# EasyEDA Pro project ProProject_Stc32f_Car副本_2024-06-03.epro, board STC32G
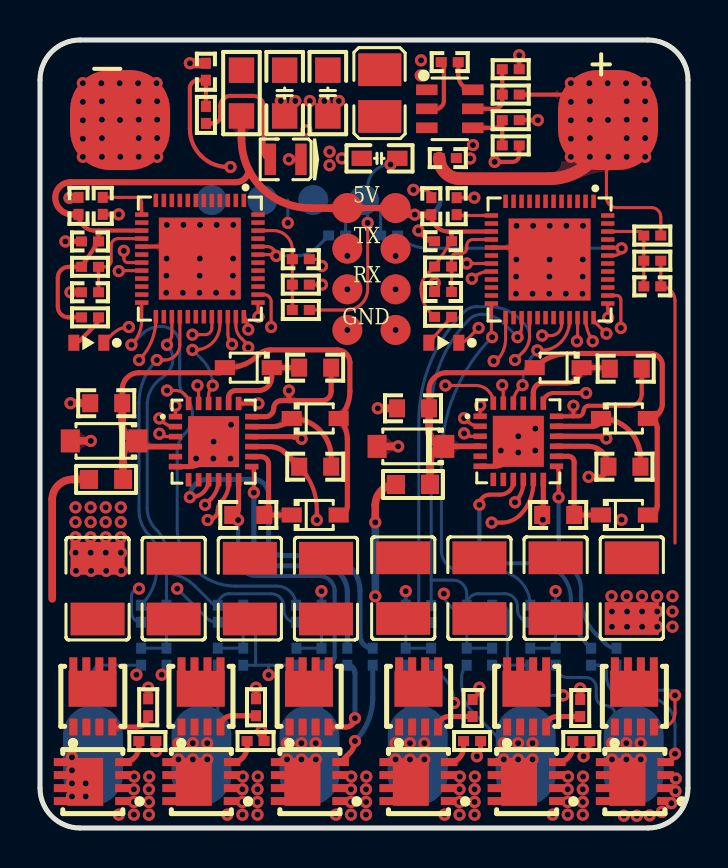
[diagram p13: board, top side]
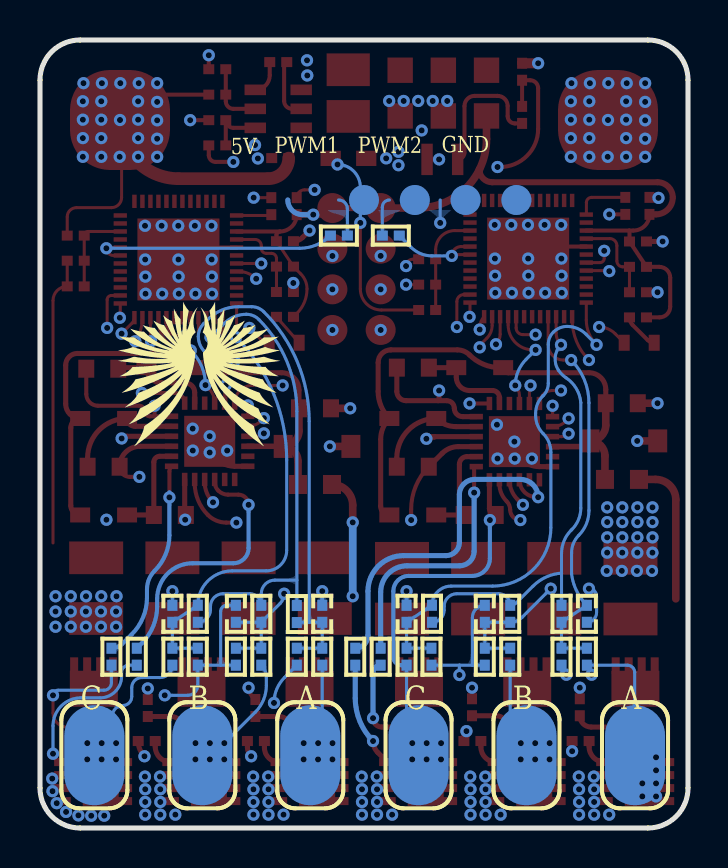
[diagram p14: board, bottom side, seen from below]

Outline 32.4 x 39.4 mm; copper layers: Top Layer, Inner1, Inner2, Bottom Layer. Coordinates in mm from the lower left corner of the outline.
Outline path: 0,37.4 0,2 arc(0.59,0.59) 2,0 30.4,0 arc(31.81,0.59) 32.4,2 32.4,37.4 arc(31.81,38.81) 30.4,39.4 2,39.4 arc(0.59,38.81) 0,37.4
Stack: Top Layer 0.035mm 外层铜厚1oz / Dielectric1 0.2104mm 7628 RC49% 8.6mil / Inner1 0.0152mm 内层铜厚 / Dielectric2 1.065mm 1.1mm H/HOZ 含铜 / Inner2 0.0152mm 内层铜厚 / Dielectric3 0.2104mm 7628 RC49% 8.6mil / Bottom Layer 0.035mm 外层铜厚1oz

## Design rules (mm)
template: 自定义配置
spacing copperThickness1oz (default): track to track 0.152, other pairs 0.152 to 0.3
spacing copperThickness2oz: track to track 0.203, other pairs 0.152 to 0.3
track width copperThickness1oz (default): min 0.152, default 0.254, max 2.54
track width copperThickness2oz: min 0.203, default 0.254, max 2.54
differential pair differentialPair (default): width min 0.127, default 0.254, max 2.54; gap min 0.152, default 0.152
via viaSize (default): diameter min 0.559, default 0.559, max 10; hole min 0.305, default 0.305, max 6.299
pour e34 uses POWGND
pour e58 uses POWGND
pour e72 uses POWGND
pour e106 uses POWGND
pour e118 uses POWGND
pour e125 uses POWGND
pour e181 uses POWGND
pour e610 uses POWGND
pour e621 uses POWGND
pour e570 uses POWGND
pour e1257 uses POWGND
pour e1387 uses POWGND
pour e1405 uses POWGND
pour e1486 uses POWGND
pour e1557 uses POWGND
pour e1626 uses POWGND
pour e4730 uses INSIDEGND
pour e12453 uses INSIDEGND
pour e12604 uses ELSEGND
pour e1581 uses POWGND
pour e1592 uses POWGND
pour e1603 uses POWGND
pour e1614 uses POWGND

## Placement (name value [footprint] x y rotation side)
C3  0.1uF  [CAPC1005[0402]S-N]  20.49 38.3 180 top
C11  4.7uF  [CAPC1608[0603]S-N_1]  13.76 23.02 180 top
C12  4.7uF  [CAPC1608[0603]S-N_1]  13.76 18.06 0 top
C13  10uF  [CAPC1608[0603]S-N_1]  3.31 21.24 0 top
C14  4.7uF  [CAPC1608[0603]S-N_1]  10.41 15.65 0 top
C22  0.1uF  [CAPC1005[0402]S-N]  13.04 28.44 180 top
C23  10uF  [C 0603_M]  16.98 33.48 180 top
C24  0.1uF  [CAPC1005[0402]S-N]  20.39 33.49 180 top
C25  22uF  [C 0805_M]  14.39 36.75 90 top
C26  22uF  [C 0805_M]  12.23 36.75 90 top
C27  100uf  [C1210]  14.3 11.97 270 top
C28  100uf  [C1210]  10.49 11.97 270 top
C29  100uf  [C1210]  6.69 11.97 270 top
C30  100uf  [C1210]  2.88 11.97 270 top
C35  10uF  [CAPC1608[0603]S-N_1]  18.65 20.98 0 top
C36  4.7uF  [CAPC1608[0603]S-N_1]  29.29 22.96 180 top
C37  4.7uF  [CAPC1608[0603]S-N_1]  29.22 18.06 0 top
C38  4.7uF  [CAPC1608[0603]S-N_1]  25.91 15.65 0 top
C48  100uf  [C1210]  18.16 11.99 270 top
C49  100uf  [C1210]  21.97 11.99 270 top
C50  100uf  [C1210]  25.78 11.99 270 top
C51  100uf  [C1210]  29.59 11.99 270 top
C52  0.1uF  [CAPC1005[0402]S-N]  3.14 31.11 90 top
C53  0.1uF  [CAPC1005[0402]S-N]  2.5 29.33 0 top
C54  0.1uF  [CAPC1005[0402]S-N]  1.93 31.11 270 top
C55  0.1uF  [CAPC1005[0402]S-N]  2.5 26.79 0 top
C56  0.1uF  [CAPC1005[0402]S-N]  5.06 10.71 90 bottom
C57  0.1uF  [CAPC1005[0402]S-N]  10.16 10.71 270 bottom
C58  0.1uF  [CAPC1005[0402]S-N]  14.07 10.71 270 bottom
C59  0.1uF  [CAPC1005[0402]S-N]  30.61 27.08 180 top
C60  0.1uF  [CAPC1005[0402]S-N]  18.29 10.71 270 bottom
C61  0.1uF  [CAPC1005[0402]S-N]  22.61 10.71 270 bottom
C62  0.1uF  [CAPC1005[0402]S-N]  25.78 10.71 270 bottom
C63  0.1uF  [CAPC1005[0402]S-N]  20.84 31.09 270 top
C64  0.1uF  [CAPC1005[0402]S-N]  20.15 29.34 0 top
C65  0.1uF  [CAPC1005[0402]S-N]  19.56 31.09 270 top
C66  0.1uF  [CAPC1005[0402]S-N]  20.15 26.8 0 top
C69  0.1uF  [CAPC1005[0402]S-N]  8.3 37.81 270 top
D1  B5819WS  [SOD-323_L1.8-W1.3-LS2.5-RD]  10.41 23.02 180 top
D2  BZT52C15-G RHG  [SOD-123_L2.8-W1.8-LS3.7-RD]  3.21 19.35 180 top
D3  B5819WS  [SOD-323_L1.8-W1.3-LS2.5-RD]  13.76 20.48 0 top
D4  B5819WS  [SOD-323_L1.8-W1.3-LS2.5-RD]  13.76 15.65 0 top
D5  B5819WS  [SOD-323_L1.8-W1.3-LS2.5-RD]  25.91 23.02 180 top
D6  B5819WS  [SOD-323_L1.8-W1.3-LS2.5-RD]  29.22 20.48 0 top
D7  B5819WS  [SOD-323_L1.8-W1.3-LS2.5-RD]  29.22 15.65 0 top
D8  BZT52C15-G RHG  [SOD-123_L2.8-W1.8-LS3.7-RD]  18.55 19.08 180 top
L1  6.8uH  [L1008]  16.99 36.75 90 top
LED1  77fc373f7f6b4e3da7045e8b6ad0bd9c  [LED Chip]  2.44 24.26 180 top
LED2  XL-0807RGB-KS  [LED-SMD_L2.0-W1.8-R-RD]  12.28 33.43 180 top
LED3  77fc373f7f6b4e3da7045e8b6ad0bd9c  [LED Chip]  20.19 24.26 180 top
PAD1  -  [小焊盘4pin]  15.37 27.95 270 top
PAD3  -  [外置焊盘]  28.4 35.4 0 top
PAD5  -  [外置焊盘]  4 35.4 0 top
PAD15  -  [小焊盘4pin]  17.78 27.95 270 top
PAD19  -  [HDR1X4-TP]  16.2 31.4 180 bottom
PAD20  -  [WirePad-4x6 bottom]  2.65 3.64 90 top
PAD21  -  [WirePad-4x6 bottom]  8.07 3.64 90 top
PAD22  -  [WirePad-4x6 bottom]  13.47 3.64 90 top
PAD23  -  [WirePad-4x6 bottom]  18.89 3.64 90 top
PAD24  -  [WirePad-4x6 bottom]  24.28 3.64 90 top
PAD25  -  [WirePad-4x6 bottom]  29.68 3.64 90 top
Q1  -  [MLPAK33-8_L3.2-W3.0-P0.65-LS3.3-BL]  2.64 6.58 0 top
Q2  -  [MLPAK33-8_L3.2-W3.0-P0.65-LS3.3-BL]  8.05 6.58 0 top
Q3  -  [MLPAK33-8_L3.2-W3.0-P0.65-LS3.3-BL]  13.46 6.58 0 top
Q4  -  [MLPAK33-8_L3.2-W3.0-P0.65-LS3.3-BL]  2.64 2.32 90 top
Q5  -  [MLPAK33-8_L3.2-W3.0-P0.65-LS3.3-BL]  8.07 2.32 90 top
Q6  -  [MLPAK33-8_L3.2-W3.0-P0.65-LS3.3-BL]  13.5 2.32 90 top
Q7  -  [MLPAK33-8_L3.2-W3.0-P0.65-LS3.3-BL]  18.93 6.58 0 top
Q8  -  [MLPAK33-8_L3.2-W3.0-P0.65-LS3.3-BL]  18.92 2.32 90 top
Q9  -  [MLPAK33-8_L3.2-W3.0-P0.65-LS3.3-BL]  24.33 6.58 0 top
Q10  -  [MLPAK33-8_L3.2-W3.0-P0.65-LS3.3-BL]  24.33 2.32 90 top
Q11  -  [MLPAK33-8_L3.2-W3.0-P0.65-LS3.3-BL]  29.72 6.58 0 top
Q12  -  [MLPAK33-8_L3.2-W3.0-P0.65-LS3.3-BL]  29.74 2.32 90 top
R12  100R  [RESC1608[0603]S-N_1]  3.3 17.43 180 top
R36  0R  [R 0805_M_1]  10.07 36.75 270 top
R45  100R  [RESC1608[0603]S-N_1]  18.65 17.18 180 top
R64  0R  [RESC1005[0402]S-N]  2.5 28.06 180 top
R65  1k  [RESC1005[0402]S-N]  6.32 8.56 90 bottom
R66  1k  [RESC1005[0402]S-N]  10.16 8.56 90 bottom
R67  1k  [RESC1005[0402]S-N]  12.83 8.56 90 bottom
R68  1k  [RESC1005[0402]S-N]  6.32 10.71 90 bottom
R69  1k  [RESC1005[0402]S-N]  8.89 10.71 90 bottom
R70  1k  [RESC1005[0402]S-N]  12.8 10.71 270 bottom
R71  5.1k  [RESC1005[0402]S-N]  5.05 8.56 270 bottom
R72  5.1k  [RESC1005[0402]S-N]  8.89 8.56 270 bottom
R73  5.1k  [RESC1005[0402]S-N]  14.07 8.56 270 bottom
R74  4.7R  [RESC1005[0402]S-N]  5.41 6.04 90 top
R75  4.7R  [RESC1005[0402]S-N]  5.37 4.35 0 top
R76  4.7R  [RESC1005[0402]S-N]  10.8 6.04 90 top
R77  4.7R  [RESC1005[0402]S-N]  10.78 4.35 0 top
R78  4.7R  [RESC1005[0402]S-N]  15.37 8.56 90 bottom
R79  4.7R  [RESC1005[0402]S-N]  16.64 8.56 90 bottom
R80  47k  [RESC1005[0402]S-N]  13.04 25.9 180 top
R81  10k  [RESC1005[0402]S-N]  13.04 27.17 0 top
R82  4.7k  [RESC1005[0402]S-N]  2.5 25.53 0 top
R83  13.3k  [RESC1005[0402]S-N]  23.54 35.39 0 top
R84  100k  [RESC1005[0402]S-N]  23.54 34.13 0 top
R85  4.7k  [RESC1005[0402]S-N]  8.3 35.65 270 top
R86  511k  [RESC1005[0402]S-N]  23.54 36.67 180 top
R87  105k  [RESC1005[0402]S-N]  23.54 37.94 0 top
R88  100R  [RESC1005[0402]S-N]  14.86 29.62 180 bottom
R89  100R  [RESC1005[0402]S-N]  17.46 29.62 0 bottom
R90  4.7R  [RESC1005[0402]S-N]  21.63 6 90 top
R91  4.7R  [RESC1005[0402]S-N]  21.6 4.35 0 top
R92  4.7R  [RESC1005[0402]S-N]  27.01 6 90 top
R93  4.7R  [RESC1005[0402]S-N]  27.06 4.35 0 top
R94  4.7R  [RESC1005[0402]S-N]  28.83 8.56 90 bottom
R95  4.7R  [RESC1005[0402]S-N]  27.56 8.56 90 bottom
R96  4.7k  [RESC1005[0402]S-N]  20.15 25.56 0 top
R97  10k  [RESC1005[0402]S-N]  30.61 28.36 0 top
R98  47k  [RESC1005[0402]S-N]  30.61 29.62 180 top
R99  1k  [RESC1005[0402]S-N]  19.56 8.56 90 bottom
R100  1k  [RESC1005[0402]S-N]  22.61 8.56 90 bottom
R101  1k  [RESC1005[0402]S-N]  24.51 8.56 90 bottom
R102  1k  [RESC1005[0402]S-N]  19.56 10.7 90 bottom
R103  1k  [RESC1005[0402]S-N]  21.34 10.71 90 bottom
R104  1k  [RESC1005[0402]S-N]  24.51 10.71 270 bottom
R105  5.1k  [RESC1005[0402]S-N]  18.29 8.56 270 bottom
R106  5.1k  [RESC1005[0402]S-N]  21.34 8.56 270 bottom
R107  5.1k  [RESC1005[0402]S-N]  25.78 8.56 270 bottom
R108  0R  [RESC1005[0402]S-N]  20.15 28.07 180 top
U1  STC32G12K128-QFN48  [QFN-48_L6.0-W6.0-P0.40-TL-EP4.1]  7.99 28.47 270 top
U3  FD6288Q  [QFN-24_L4.0-W4.0-P0.50-BL-EP2.6]  8.68 19.32 270 top
U4  TPS54302DDCR  [SOT-23-6_L2.9-W1.6-P0.95-LS2.8-BL]  20.49 35.96 270 top
U6  STC32G12K128-QFN48  [QFN-48_L6.0-W6.0-P0.40-TL-EP4.1]  25.48 28.43 270 top
U7  FD6288Q  [QFN-24_L4.0-W4.0-P0.50-BL-EP2.6]  23.92 19.34 270 top

## Footprints (pads in the part's own frame, mm; a bottom-side part is the same pattern mirrored in y, then rotated)
C1210
  rect 1.635x2.7 smd: 1(-1.518,0) 2(1.518,0)
C 0603_M
  rect 1.016x0.762 smd: 1(-0.889,0) 2(0.889,0)
C 0805_M
  rect 1.27x1.27 smd: 1(-1.143,0) 2(1.143,0)
CAPC1005[0402]S-N
  rect 0.55x0.5 smd: 1(-0.425,0) 2(0.425,0)
CAPC1608[0603]S-N_1
  rect 0.8x0.9 smd: 1(-0.8,0) 2(0.8,0)
HDR1X4-TP
  rrect 1.5x1.5 smd: 1(0,0)
  round 1.5 smd: 2(2.54,0) 3(5.08,0) 4(7.62,0)
L1008
  rect 1.635x2.16 smd: 1(-1.167,0) 2(1.167,0)
LED Chip
  rect 0.55x0.8 smd: A(0.75,0) C(-0.75,0)
LED-SMD_L2.0-W1.8-R-RD
  rect 0.57x1.57 smd: 1(0.765,0) 2(-0.765,0)
MLPAK33-8_L3.2-W3.0-P0.65-LS3.3-BL
  rect 0.4x0.83 smd: 1(-0.975,1.535) 1(-0.325,1.535) 1(0.325,1.535) 1(0.975,1.535) 2(0.975,-1.535) 3(-0.975,-1.535) 3(-0.325,-1.535) 3(0.325,-1.535)
  rect 2.4x1.8 smd: 1(-0.01,0.38)
QFN-24_L4.0-W4.0-P0.50-BL-EP2.6
  rect 0.28x0.665 smd: 1(-1.25,-1.907) 2(-0.75,-1.907) 3(-0.25,-1.907) 4(0.25,-1.907) 5(0.75,-1.907) 6(1.25,-1.907) 13(1.25,1.907) 14(0.75,1.907) 15(0.25,1.907) 16(-0.25,1.907) 17(-0.75,1.907) 18(-1.25,1.907)
  rect 0.665x0.28 smd: 7(1.907,-1.25) 8(1.907,-0.75) 9(1.907,-0.25) 10(1.907,0.25) 11(1.907,0.75) 12(1.907,1.25) 19(-1.907,1.25) 20(-1.907,0.75) 21(-1.907,0.25) 22(-1.907,-0.25) 23(-1.907,-0.75) 24(-1.907,-1.25)
  rect 2.55x2.55 smd: 25(0,0)
QFN-48_L6.0-W6.0-P0.40-TL-EP4.1
  rect 0.665x0.224 smd: 1(-2.908,2.2) 2(-2.908,1.8) 3(-2.908,1.4) 4(-2.908,1) 5(-2.908,0.6) 6(-2.908,0.2) 7(-2.908,-0.2) 8(-2.908,-0.6) 9(-2.908,-1) 10(-2.908,-1.4) 11(-2.908,-1.8) 12(-2.908,-2.2) 25(2.908,-2.2) 26(2.908,-1.8) 27(2.908,-1.4) 28(2.908,-1) 29(2.908,-0.6) 30(2.908,-0.2) 31(2.908,0.2) 32(2.908,0.6) 33(2.908,1) 34(2.908,1.4) 35(2.908,1.8) 36(2.908,2.2)
  rect 0.224x0.665 smd: 13(-2.2,-2.908) 14(-1.8,-2.908) 15(-1.4,-2.908) 16(-1,-2.908) 17(-0.6,-2.908) 18(-0.2,-2.908) 19(0.2,-2.908) 20(0.6,-2.908) 21(1,-2.908) 22(1.4,-2.908) 23(1.8,-2.908) 24(2.2,-2.908) 37(2.2,2.908) 38(1.8,2.908) 39(1.4,2.908) 40(1,2.908) 41(0.6,2.908) 42(0.2,2.908) 43(-0.2,2.908) 44(-0.6,2.908) 45(-1,2.908) 46(-1.4,2.908) 47(-1.8,2.908) 48(-2.2,2.908)
  rect 4.1x4.1 smd: 49(0,0)
R 0805_M_1
  rect 1.27x1.27 smd: 1(-1.143,0) 2(1.143,0)
RESC1005[0402]S-N
  rect 0.55x0.5 smd: 1(-0.425,0) 2(0.425,0)
RESC1608[0603]S-N_1
  rect 0.9x0.95 smd: 1(-0.85,0) 2(0.85,0)
SOD-123_L2.8-W1.8-LS3.7-RD
  rect 0.95x1.15 smd: 1(-1.692,0) 2(1.692,0)
SOD-323_L1.8-W1.3-LS2.5-RD
  rect 1x0.75 smd: 1(-1.173,0) 2(1.173,0)
SOT-23-6_L2.9-W1.6-P0.95-LS2.8-BL
  rect 0.532x1.072 smd: 1(-0.95,-1.149) 2(0,-1.149) 3(0.95,-1.149) 4(0.95,1.149) 5(0,1.149) 6(-0.95,1.149)
WirePad-4x6 bottom
  rrect 5x3 smd far side: 1(0,0)
外置焊盘
  rrect 5x5 smd: 1(0,0)
小焊盘4pin
  round 1.5 smd: 1(-3.048,0) 2(-1.016,0) 3(1.016,0) 4(3.048,0)

## Nets
As in the schematic.

Pads without a net: U1 1 2 3 4 5 6 7 8 9 10 11 12 14 18 21 22 23 26 29 30 31 39 40 41 42 45 47 48; U3 5 7 8 21; U6 1 2 3 4 5 6 7 8 9 10 11 12 14 18 21 22 23 26 29 30 31 39 40 41 42 45 47 48; U7 5 7 8 21

## Via types
v1: diameter 0.61, hole 0.305, Top Layer to Bottom Layer, 340 vias

## Routing (per net, layer and track width the routed paths; a pad name or vN(x,y) marks a point on that pad's centre or on a via; arc(x,y) is an arc through that point)
+5V: length 45.3
  Top Layer w0.152: C64.2 19.73,28.07 19.36,27.7 arc(19.13,27.36) 19.05,26.95 arc(19.18,26.29) 19.56,25.73 19.73,25.56
  Top Layer w0.203: 2.94,29.87 2.74,29.87 arc(2.16,30.11) C54.2 ; 2.94,29.87 U1.15 ; 2.94,29.87 arc(2.93,29.87) 2.93,29.86 C53.2 R64.2 1.44,28.06 arc(1.05,27.9) 0.89,27.51 0.89,26.07 arc(1.05,25.69) 1.43,25.53 R82.1 ; C64.2 20.58,29.65 arc(20.53,29.78) 20.41,29.83 ; U6.15 20.41,29.83 ; 20.41,29.83 arc(19.81,30.07) C65.2
  Top Layer w0.305: C54.2 1.61,30.68 arc(1.01,30.93) 0.76,31.53 arc(0.99,32.06) 1.52,32.29 9.79,32.29 arc(10.24,32.47) 10.43,32.92 ; PAD1.1 PAD15.1 arc(17.88,30.76) 18.11,30.67 v1(18.74,30.67) C65.2
  Top Layer w0.381: PAD1.1 13.52,31 arc(11.7,31.52) 10.43,32.92 arc(10.16,33.67) 10.07,34.45 R36.2
  Bottom Layer w0.254: v1(18.74,30.67) 19.28,30.67 arc(19.8,30.88) 20.01,31.4
GND: length 59.6
  Top Layer w0.152: R97.2 31.04,27.08 arc(31.54,26.87) 31.75,26.37 31.75,14.25 ; v1(18.67,31.91) 19.18,31.91 arc(19.45,31.79) C65.1 ; v1(19.73,27.25) 19.73,26.82 arc(19.73,26.81) C66.1 ; R81.2 v1(14.1,27.17) ; C22.1 13.75,28.44 arc(14,28.34) v1(14.1,28.1) ; C63.1 v1(21.72,31.52)
  Top Layer w0.203: R87.2 v1(23.96,38.64) ; U6.17 23.49,29.03 ; C55.1 v1(1.52,26.79) ; LED2.2 v1(12.45,33.43) ; C52.1 v1(3.94,30.68) ; R83.2 v1(24.89,35.39) ; 5.09,29.07 6.06,29.07
  Top Layer w0.254: C53.1 v1(1.27,29.33) ; v1(18.92,29.88) 19.27,29.53 arc(19.48,29.39) C64.1 ; U7.6 22.67,18.09 arc(23.33,18.28) 23.79,18.8 arc(23.88,19.06) U7.25 ; U3.6 7.43,18.07 arc(8.31,18.43) v1(8.68,19.32)
  Top Layer w0.305: v1(1.48,31.51) 1.9,31.51 arc(1.92,31.51) C54.1
  Top Layer w0.381: C13.1 v1(1.52,21.24) ; D8.2 v1(17.91,19.08) ; 1.51,19.35 v1(2.54,19.35) ; C35.1 v1(16.89,20.98)
  Top Layer w0.508: C69.1 v1(7.49,38.24)
  Bottom Layer w0.152: 11.43,8.14 12.83,8.14 ; 11.43,8.14 v1(11.43,7.65) ; 11.43,8.14 10.78,8.14 ; R100.1 23.37,8.14 ; 23.37,8.14 R101.1 24.51,7.14 arc(24.66,6.78) 25.02,6.63 v1(26.16,6.63) ; 23.37,8.14 arc(23.37,8.14) 23.37,8.14 23.37,10.83 arc(23.28,11.04) 23.06,11.14 C61.1 ; 12.39,31.4 v1(12.39,30.26) ; R99.1 20.18,7.52 arc(20.56,6.94) v1(20.7,6.25) ; R65.1 6.32,7.91 arc(6.25,7.74) v1(6.08,7.66) ; C62.1 v1(25.78,11.84) ; 10.78,8.14 R66.1 ; 10.78,8.14 10.78,10.51 arc(10.6,10.95) C57.1 ; C56.1 arc(4.71,10.43) 4.57,10.77 4.57,11.59 arc(4.68,11.86) v1(4.95,11.97)
  Bottom Layer w0.203: C60.1 v1(18.29,11.84) ; C58.1 v1(14.07,11.84)
  vias: v1(1.78,16.03) v1(1.78,15.3) v1(1.78,14.53) v1(1.78,13.77) v1(1.8,12.86) v1(2.14,37.24) v1(2.14,36.31) v1(2.14,35.38) v1(2.14,34.46) v1(2.14,33.56) v1(2.53,16.03) v1(2.53,15.3) v1(2.53,14.53) v1(2.53,13.77) v1(2.55,12.86) v1(3.06,37.24) v1(3.09,36.34) v1(3.09,35.42) v1(3.09,34.49) v1(3.09,33.56) v1(3.29,16.03) v1(3.29,15.3) v1(3.29,14.53) v1(3.29,13.77) v1(3.31,12.86) v1(3.94,0.67) v1(3.98,37.24) v1(4,35.4) v1(4.02,33.56) v1(4.04,16.03) v1(4.04,15.3) v1(4.04,14.53) v1(4.04,13.77) v1(4.06,12.86) v1(4.71,2.57) v1(4.69,1.94) v1(4.69,1.3) v1(4.69,0.67) v1(4.91,37.24) v1(4.94,36.34) v1(4.94,35.42) v1(4.94,34.49) v1(4.94,33.56) v1(5.45,1.94) v1(5.45,1.3) v1(5.45,0.67) v1(5.46,2.57) v1(5.83,37.24) v1(5.86,36.34) v1(5.86,35.42) v1(5.86,34.49) v1(5.86,33.56) v1(6.34,30.16) v1(6.33,28.47) v1(6.32,27.62) v1(6.31,26.76) v1(7.14,26.76) v1(7.17,30.16) v1(7.81,18.47) v1(8,30.16) v1(7.99,28.47) v1(7.98,27.62) v1(7.97,26.76) v1(8.67,18.47) v1(8.83,30.16) v1(8.81,26.76) v1(9.37,0.67) v1(9.53,18.47) v1(9.65,27.62) v1(9.64,26.76) v1(9.55,20.16) v1(9.66,30.16) v1(9.66,28.47) v1(10.13,2.57) v1(10.12,1.94) v1(10.12,1.3) v1(10.12,0.67) v1(10.89,2.57) v1(10.87,1.94) v1(10.87,1.3) v1(10.87,0.67) v1(12.04,36.35) v1(12.76,36.35) v1(13.32,34.88) v1(13.49,36.35) v1(14.22,36.35) v1(14.48,33.81) v1(14.48,33.14) v1(14.79,0.67) v1(14.94,36.35) v1(15.09,33.48) v1(15.37,24.9) v1(15.55,1.94) v1(15.55,1.3) v1(15.55,0.67) v1(15.56,2.57) v1(16.31,2.57) v1(16.3,1.94) v1(16.3,1.3) v1(16.3,0.67) v1(17.78,24.9) v1(19.04,37.63) v1(19.05,38.38) v1(20.22,0.67) v1(20.99,2.57) v1(20.98,1.94) v1(20.98,1.3) v1(20.98,0.67) v1(21.51,33.48) v1(21.65,34.15) v1(21.74,2.57) v1(21.73,1.94) v1(21.73,1.3) v1(21.73,0.67) v1(23.04,18.87) v1(23.82,30.11) v1(23.82,28.43) v1(23.81,27.57) v1(23.8,26.71) v1(23.92,19.59) v1(23.92,18.78) v1(24.63,26.71) v1(24.66,30.11) v1(24.76,19.97) v1(24.76,18.87) v1(25.49,30.11) v1(25.48,28.43) v1(25.47,27.57) v1(25.46,26.71) v1(25.63,0.67) v1(26.32,30.11) v1(26.29,26.71) v1(26.4,2.57) v1(26.39,1.94) v1(26.39,1.3) v1(26.39,0.67) v1(27.14,28.43) v1(27.13,27.57) v1(27.12,26.71) v1(27.14,1.94) v1(27.14,1.3) v1(27.14,0.67) v1(27.15,30.11) v1(27.15,2.57) v1(29.19,0.62) v1(29.84,0.61) v1(30.48,0.63) v1(31.1,0.8) v1(31.56,1.24) v1(31.79,2.47) v1(31.78,1.84)
VBAT: length 44.9
  Top Layer w0.152: R80.1 15.33,25.9 arc(16.07,26.21) 16.38,26.95 v1(16.38,30.26) ; R98.1 31.04,30.56 arc(30.9,30.88) 30.58,31.02 28.83,31.02 arc(28.47,31.17) 28.32,31.53 28.32,35.32 arc(28.34,35.38) v1(28.4,35.4)
  Top Layer w0.203: R86.1 26.1,36.67
  Top Layer w0.381: R12.2 1.63,17.43 arc(0.91,17.13) 0.61,16.41 0.61,11.46 ; v1(16.76,15.28) 16.76,16.14 arc(17.07,16.87) R45.2
  Top Layer w0.635: C24.2 arc(20.27,32.77) 20.99,32.47 25.47,32.47 arc(26.65,32.72) 27.64,33.43 arc(28.06,34.03) 28.32,34.72 arc(28.38,35.06) v1(28.4,35.4)
  Bottom Layer w0.152: v1(16.38,30.26) 16.38,32.03 arc(16.72,32.84) v1(17.53,33.18)
  Bottom Layer w0.381: v1(16.76,15.28) v1(16.76,11.59)
  vias: v1(26.54,37.24) v1(26.54,36.31) v1(26.54,35.38) v1(26.54,34.46) v1(26.54,33.56) v1(27.46,37.24) v1(27.49,36.34) v1(27.49,35.42) v1(27.49,34.49) v1(27.49,33.56) v1(28.38,37.24) v1(28.42,33.56) v1(28.57,11.59) v1(28.6,10.83) v1(28.6,10.06) v1(29.08,15.41) v1(29.31,37.24) v1(29.34,36.34) v1(29.34,35.42) v1(29.34,34.49) v1(29.34,33.56) v1(29.34,11.59) v1(29.35,10.83) v1(29.35,10.06) v1(30.1,11.59) v1(30.11,10.83) v1(30.11,10.06) v1(30.23,37.24) v1(30.26,36.34) v1(30.26,35.42) v1(30.26,34.49) v1(30.26,33.56) v1(30.86,11.59) v1(30.86,10.83) v1(30.86,10.06) v1(31.62,11.59) v1(31.62,10.83) v1(31.62,10.06)
VCC12V: length 28.1
  Top Layer w0.254: C13.2 4.11,21.92 arc(4.36,22.52) 4.95,22.76 8.99,22.76 arc(9.17,22.84) D1.2 9.39,23.02 arc(10.22,23.18) 10.92,23.65 arc(11.2,23.84) 11.53,23.91 14.86,23.91 arc(15.31,23.72) 15.49,23.27 15.49,21.83 arc(15.35,21.1) D3.2 arc(15.25,20) 15.37,19.43 15.37,16.09 arc(15.24,15.78) D4.2
  Top Layer w0.28: U3.4 5.19,19.07 arc(4.98,19.15) D2.1
  Top Layer w0.381: C13.2 4.11,20.14 arc(4.34,19.59) D2.1 arc(4.37,19.14) 4.15,18.61 R12.1
VCC12V1: length 28.6
  Top Layer w0.254: C35.2 19.45,21.89 arc(19.71,22.51) 20.32,22.76 24.12,22.76 arc(24.45,22.83) D5.2 arc(25.52,23.54) 26.45,23.73 30.53,23.73 arc(30.94,23.56) 31.12,23.14 31.12,21.2 arc(30.9,20.69) D6.2 arc(30.72,20.34) 30.86,20.01 30.86,16.12 arc(30.72,15.79) D7.2
  Top Layer w0.28: U7.4 20.24,19.09 arc(20.24,19.08) D8.1
  Top Layer w0.381: C35.2 19.45,19.87 arc(19.68,19.31) D8.1 arc(19.72,18.86) 19.5,18.34 R45.1
ABMF1_37: length 20.1
  Top Layer w0.152: U1.28 6.99,24.17 arc(6.77,23.62) 6.22,23.4 v1(5.84,23.4)
  Bottom Layer w0.152: C56.2 5.14,11.14 ; C56.2 R68.1 R65.2 R71.1 ; C56.2 arc(5.2,11.29) 5.33,11.46 arc(5.66,12.05) 5.82,12.7 5.82,13.77 arc(5.73,14.24) 5.46,14.64 arc(5.09,15.2) 4.95,15.86 4.95,21.25 arc(5.18,22.41) v1(5.84,23.4)
ABMF2_37: length 27.8
  Top Layer w0.152: U6.28 24.48,24.61 arc(24.39,24.16) 24.14,23.79 v1(23.75,23.4)
  Bottom Layer w0.152: 18.94,10.29 19.56,10.29 ; 18.94,10.29 18.94,20.33 arc(19.53,23.3) 21.21,25.81 arc(21.49,26) 21.82,26.07 22.47,26.07 arc(23.3,25.9) 24,25.43 24.22,25.22 arc(24.42,24.92) 24.49,24.57 arc(24.41,24.17) 24.18,23.83 v1(23.75,23.4) ; 18.94,10.29 C60.2 R105.1 R99.2
BATADC1_03: length 5.3
  Top Layer w0.152: U1.46 11.66,29.87 arc(12.34,29.59) 12.62,28.91 C22.2 R81.1 R80.2
BATADC2_03: length 4.5
  Top Layer w0.152: C59.2 R97.1 R98.2 arc(30.13,29.77) 29.98,29.83 U6.46
BBMF1_51: length 20.9
  Top Layer w0.152: U1.25 5.79,25.42 arc(5.57,24.33) v1(4.95,23.4)
  Inner2 w0.152: v1(4.95,23.4) 4.95,19.67 arc(5.09,19.01) 5.46,18.45 arc(5.93,17.74) 6.1,16.91 6.1,13.82 arc(6.29,12.82) v1(6.86,11.97)
  Bottom Layer w0.152: R72.1 R66.2 C57.2 R69.1 arc(8.57,10.35) 8.3,10.53 v1(6.86,11.97)
BBMF2_51: length 20.5
  Top Layer w0.152: U6.25 23.28,24.46 arc(23.16,23.86) 22.82,23.35
  Inner2 w0.152: v1(20.19,11.71) 20.19,19.21 arc(20.5,20.73) 21.36,22.03 v1(22.68,23.35)
  Bottom Layer w0.152: R103.1 R106.1 R100.2 ; R103.1 20.4,11.23 arc(20.25,11.45) v1(20.19,11.71) ; R103.1 22.6,10.29
CBMF1_50: length 27.3
  Top Layer w0.152: U1.24 5.09,25.4 arc(4.95,24.73) v1(4.57,24.16)
  Bottom Layer w0.152: v1(4.57,24.16) 5.1,24.69 arc(5.53,24.98) 6.04,25.08 ; R67.2 R73.1 C58.2 R70.1 arc(12.52,11.81) 11.84,12.09 9.78,12.09 arc(7.71,12.95) 6.86,15.02 6.86,18.8 arc(6.96,19.29) 7.24,19.72 arc(7.52,20.14) 7.62,20.64 7.62,20.73 arc(7.53,21.2) 7.26,21.6 7.24,21.62 arc(7.05,21.9) 6.99,22.23 6.99,24.18 arc(6.92,24.51) 6.73,24.8 arc(6.42,25.01) 6.05,25.08
CBMF2_50: length 23.1
  Top Layer w0.152: U6.24 22.57,24.63 arc(22.58,24.58) v1(22.61,24.54)
  Bottom Layer w0.152: R101.2 R107.1 C62.2 R104.1 arc(24.01,12.35) 22.79,12.86 21.09,12.86 arc(20.37,13.16) 20.07,13.88 20.07,18.41 arc(20.73,21.73) v1(22.61,24.54)
DBRX1_30: length 14
  Top Layer w0.152: U1.19 4.4,28.27 arc(4.25,28.33) 4.19,28.48 v1(4.19,28.86)
  Inner2 w0.152: v1(4.19,28.86) arc(4.61,29.14) 5.11,29.24 13.06,29.24 arc(14.69,28.56) v1(15.37,26.93)
DBRX2_30: length 5.1
  Top Layer w0.152: U6.19 v1(21.34,28.23)
  Inner2 w0.152: v1(21.34,28.23) 20.9,28.23 arc(19.21,27.89) v1(17.78,26.93)
DBTX1_31: length 14.8
  Top Layer w0.152: U1.20 3.97,27.87 arc(3.95,27.86) v1(3.94,27.84)
  Inner2 w0.152: v1(15.37,28.61) 15.25,28.72 arc(14.25,29.39) 13.08,29.62 4.35,29.62 arc(3.79,29.39) 3.56,28.83 3.56,28.76 arc(3.65,28.27) v1(3.94,27.84)
DBTX2_31: length 6.6
  Top Layer w0.152: U6.20 22.47,27.83 arc(21.99,27.73) v1(21.59,27.46)
  Inner2 w0.152: v1(21.59,27.46) 21.61,27.48 arc(21.88,27.88) 21.97,28.35 arc(21.82,28.71) 21.46,28.86 18.4,28.86 arc(18.07,28.79) v1(17.78,28.6)
EN1: length 3.3
  Top Layer w0.203: U4.5 22.73,35.96 arc(23,36.07) 23.11,36.34 R86.2 R87.1
HOA1: length 21.4
  Top Layer w0.203: R74.2 v1(5.41,7.02) ; v1(10.92,21.23) U3.19
  Inner2 w0.203: v1(5.41,7.02) 6.86,7.02 arc(7.4,7.24) 7.62,7.78 7.62,11.88 arc(7.49,12.55) 7.11,13.11 arc(6.74,13.67) 6.6,14.34 6.6,16.6 arc(6.88,17.28) 7.56,17.56 10.03,17.56 arc(10.66,17.82) 10.92,18.45 v1(10.92,21.23)
HOA2: length 23
  Top Layer w0.203: R90.2 21.79,6.59 arc(21.92,6.78) v1(21.97,7.02) ; v1(27.31,21.75) 25.67,21.75 arc(25.31,21.6) U7.19
  Inner2 w0.203: v1(27.31,21.75) 27.31,19.31 arc(26.83,18.16) 25.68,17.68 21.97,17.68 arc(21.52,17.5) 21.34,17.05 21.34,15.68 arc(21.43,15.18) 21.72,14.76 arc(21.91,14.48) 21.97,14.15 v1(21.97,7.02)
HOB1: length 17.2
  Top Layer w0.203: R76.2 v1(10.8,7.02)
  Top Layer w0.254: 12.67,19.57 U3.16 ; 12.67,19.57 12.82,19.57 arc(12.96,19.54) v1(13.08,19.46) ; 12.67,19.57 arc(12.69,19.56) 12.7,19.54
  Inner2 w0.203: v1(10.8,7.02) 10.8,15.53 arc(11.02,16.06) 11.56,16.29 12.22,16.29 arc(12.83,16.54) 13.08,17.15 v1(13.08,19.46)
HOB2: length 16.2
  Top Layer w0.203: R92.2 v1(27.01,6.98)
  Top Layer w0.254: 28.06,19.59 U7.16 ; 28.06,19.59 arc(28.2,19.56) v1(28.32,19.48) arc(28.2,19.56) 28.06,19.59
  Inner2 w0.203: v1(27.01,6.98) 27.01,14.98 arc(27.22,16.03) 27.81,16.92 arc(28.19,17.48) 28.32,18.14 v1(28.32,19.48)
HOC1: length 12.9
  Top Layer w0.203: v1(10.69,16.77) 10.69,17.96 arc(10.66,18.04) U3.13
  Bottom Layer w0.254: R78.2 15.37,11.79 arc(14.98,12.72) 14.05,13.11 11.42,13.11 arc(10.91,13.32) 10.69,13.84 v1(10.69,16.77)
HOC2: length 10.5
  Top Layer w0.203: v1(25.93,16.53) 25.93,17.83 arc(25.9,17.97) U7.13
  Bottom Layer w0.203: 25.93,16.79 25.93,14.65 arc(26.12,13.68) 26.67,12.86 arc(26.95,12.43) 27.05,11.94 27.05,11.52 arc(27.25,10.53) 27.81,9.68 28.28,9.22 arc(28.53,9.05) R94.2
LED1_44: length 6.5
  Top Layer w0.152: v1(7.62,24.67) 8.25,24.67 arc(8.49,24.77) 8.59,25.01 U1.32 ; LED1.C 3.65,24.72 arc(4.01,24.96) v1(4.44,25.05)
  Inner2 w0.152: v1(4.44,25.05) 6.7,25.05 arc(7.2,24.95) v1(7.62,24.67)
LED2_44: length 6.3
  Top Layer w0.152: v1(25.11,24.62) 25.53,24.62 arc(25.92,24.78) 26.08,25.17 U6.32 ; v1(21.93,25) 21.36,24.44 arc(21.17,24.31) LED3.C
  Inner2 w0.152: v1(25.11,24.62) arc(24.49,25.03) 23.77,25.18 22.35,25.18 arc(22.12,25.13) v1(21.93,25)
LOA1: length 16.4
  Top Layer w0.203: R75.2 v1(5.79,3.84) ; U3.11 9.43,17.21 arc(9.34,16.74) 9.07,16.34 arc(8.94,16.14) 8.89,15.91 arc(8.74,15.55) v1(8.38,15.4)
  Inner2 w0.203: v1(5.79,3.84) 5.79,4.43 arc(6.03,5) 6.6,5.24 7.49,5.24 arc(8.12,5.5) 8.38,6.13 v1(8.38,15.4)
LOA2: length 16.4
  Top Layer w0.203: U7.11 24.67,17.25 arc(24.49,16.38) 24,15.65 arc(23.58,15.37) 23.08,15.27 v1(22.58,15.27)
  Top Layer w0.254: R91.2 22.03,4.03 arc(21.98,3.79) v1(21.84,3.59)
  Inner2 w0.203: 22.61,15.27 22.61,15.24 ; 22.61,15.24 22.61,15.21 ; 22.61,15.24 arc(22.6,15.26) v1(22.58,15.27) ; 22.61,15.21 22.61,5.43 arc(22.6,5.27) 22.59,5.11 arc(22.34,4.29) v1(21.84,3.59) ; 22.61,15.21 arc(22.6,15.24) v1(22.58,15.27) ; 22.61,15.21 arc(22.6,15.24) v1(22.58,15.27)
LOB1: length 15
  Top Layer w0.203: v1(8.25,16.16) 8.52,16.43 arc(8.82,16.88) U3.10
  Top Layer w0.254: R77.2 11.2,4.72 arc(11.17,4.81) v1(11.08,4.84)
  Inner2 w0.203: v1(11.08,4.84) arc(9.8,5.37) 9.27,6.65 9.27,15.14 arc(8.97,15.86) v1(8.25,16.16)
LOB2: length 17.4
  Top Layer w0.203: U7.10 24.17,17.29 arc(24.06,16.75) v1(23.75,16.29)
  Top Layer w0.254: R93.2 27.49,4.34 arc(27.41,3.93) v1(27.18,3.59)
  Inner2 w0.203: v1(27.18,3.59) 27.18,4.58 arc(27.02,4.96) 26.65,5.11 24.87,5.11 arc(24.44,5.29) 24.26,5.72 24.26,15.06 arc(24.17,15.61) 23.91,16.1 arc(23.83,16.2) v1(23.75,16.29)
LOC1: length 17.9
  Top Layer w0.203: v1(7.49,16.54) 7.56,16.54 arc(8.17,16.8) U3.9
  Bottom Layer w0.254: R79.2 arc(16.19,9.18) 16,9.62 16,11.84 arc(15.48,13.1) 14.22,13.62 12.1,13.62 arc(11.63,13.81) 11.43,14.29 11.43,16.67 arc(11.21,17.21) 10.67,17.43 8.38,17.43 arc(7.75,17.17) v1(7.49,16.54)
LOC2: length 13.4
  Top Layer w0.203: U7.9 23.67,17.3 arc(23.62,17.07) 23.49,16.87 arc(23.26,16.72) 23,16.67 22.48,16.67 arc(22.12,16.52) v1(21.97,16.16)
  Bottom Layer w0.203: v1(21.97,16.16) 21.97,14 arc(22.19,13.46) 22.73,13.24 24.76,13.24 arc(26.02,12.72) 26.54,11.46 26.54,11.08 arc(26.74,10.09) 27.3,9.25 R95.2
MID1_36: length 23.5
  Top Layer w0.152: U1.27 6.59,24.75 arc(6.53,24.43) v1(6.35,24.16)
  Bottom Layer w0.152: 6.32,12.74 6.32,13.72 arc(6.2,14.35) 5.84,14.89 5.81,14.93 arc(5.48,15.42) 5.36,16 5.36,21.26 arc(5.59,21.97) 6.1,22.51 arc(6.31,22.68) 6.48,22.89 arc(6.64,23.55) v1(6.35,24.16) ; 6.32,12.74 R68.2 ; 6.32,12.74 arc(7.09,12.55) 7.75,12.09 8.58,11.27 arc(8.72,11.17) R69.2 arc(9.06,11.54) 9.47,11.71 11.56,11.71 arc(12.01,11.53) 12.19,11.08 12.19,10.9 arc(12.37,10.46) R70.2
MID2_36: length 25.9
  Top Layer w0.152: U6.27 24.08,25.03 arc(24.03,24.77) v1(23.88,24.54)
  Bottom Layer w0.152: 19.56,12.39 20.66,12.39 arc(21.14,12.19) 21.34,11.71 21.34,11.14 ; 19.56,12.39 19.56,20.83 arc(20.05,23.32) 21.46,25.43 arc(21.74,25.62) 22.08,25.68 22.1,25.68 arc(22.68,25.57) 23.18,25.23 v1(23.88,24.54) ; 19.56,12.39 R102.2 ; 21.34,11.14 R103.2 arc(21.33,11.13) 21.32,11.12 ; 21.34,11.14 arc(21.51,11.55) 21.91,11.71 23.24,11.71 arc(23.69,11.53) 23.88,11.08 23.88,10.92 arc(24.06,10.47) R104.2
PWMAH1_20: length 5.6
  Top Layer w0.152: U3.22 8.43,21.63 arc(8.48,21.9) v1(8.64,22.13) ; v1(7.62,23.91) 7.75,23.91 arc(8.63,24.27) 8.99,25.15 U1.33
  Bottom Layer w0.152: v1(7.62,23.91) 8.1,23.43 arc(8.5,22.83) v1(8.64,22.13)
PWMAH2_20: length 5.6
  Top Layer w0.152: v1(24.13,22.14) 23.98,22 arc(23.75,21.65) U7.22 ; v1(24.87,23.88) 25.05,23.88 arc(25.58,23.99) 26.03,24.29 arc(26.36,24.78) 26.48,25.36 U6.33
  Bottom Layer w0.152: v1(24.87,23.88) 24.83,23.84 arc(24.31,23.06) v1(24.13,22.14)
PWMAL1_21: length 6.4
  Top Layer w0.152: U3.1 v1(6.77,21.11) ; U1.34 9.39,24.69 arc(9.45,24.42) v1(9.6,24.19)
  Inner2 w0.152: v1(9.6,24.19) arc(9.2,24.11) 8.86,23.88 7.25,22.27 arc(6.9,21.74) v1(6.77,21.11)
PWMAL2_21: length 8
  Top Layer w0.152: U6.34 26.88,24.37 arc(26.87,24.35) v1(26.85,24.34) ; v1(22.01,21.13) U7.1
  Inner2 w0.152: v1(22.01,21.13) arc(24.22,21.57) 26.09,22.82 26.31,23.04 arc(26.71,23.63) v1(26.85,24.34)
PWMBH1_22: length 5.9
  Top Layer w0.152: U1.35 9.79,25.13 arc(9.86,24.78) 10.06,24.49 10.34,24.21 arc(10.4,24.13) v1(10.41,24.03) ; U3.23 7.93,21.99 arc(7.92,22.07) v1(7.87,22.13)
  Inner2 w0.152: v1(10.41,24.03) 9.67,23.29 arc(9.37,23.09) 9.02,23.02 arc(8.78,22.97) 8.58,22.84 v1(7.87,22.13)
PWMBH2_22: length 8.2
  Top Layer w0.152: U7.23 23.17,22.01 arc(23.15,22.08) v1(23.11,22.14) ; U6.35 arc(27.37,24.9) v1(27.63,24.34)
  Inner2 w0.152: v1(27.63,24.34) 27.32,24.65 arc(27.02,24.85) 26.67,24.92 arc(26.31,24.77) 26.16,24.41 26.16,24.32 arc(25.78,23.55) 25.02,23.14 arc(24.43,22.99) 23.88,22.73 arc(23.48,22.46) v1(23.11,22.14)
PWMBL1_23: length 9.4
  Top Layer w0.152: v1(10.41,24.92) 10.41,25.03 arc(10.36,25.32) U1.36 ; v1(5.97,20.48) 6.1,20.35 arc(6.41,20.14) U3.2
  Inner2 w0.152: v1(5.97,20.48) arc(7.96,20.87) 9.65,22 10.37,22.72 arc(10.83,23.41) 11,24.24 11,24.34 arc(10.83,24.75) v1(10.41,24.92)
PWMBL2_23: length 10.7
  Top Layer w0.152: v1(28.32,24.72) 27.79,25.25 arc(27.71,25.37) U6.36 ; v1(21.21,20.49) 21.33,20.36 arc(21.64,20.16) U7.2
  Inner2 w0.152: v1(21.21,20.49) arc(24.27,21.15) 26.8,23.02 arc(27.28,23.43) 27.81,23.78 arc(28.21,24.17) v1(28.32,24.72)
PWMCH1_24: length 8.2
  Top Layer w0.152: v1(6.35,21.87) 6.78,21.87 arc(7.24,21.68) U3.24 ; U1.37 10.9,25.61 arc(10.91,25.58) v1(10.92,25.56)
  Inner2 w0.152: v1(6.35,21.87) 9.4,24.93 arc(10.1,25.39) v1(10.92,25.56)
PWMCH2_24: length 14.6
  Top Layer w0.152: v1(20.27,22.13) 21.78,22.13 arc(22.41,21.87) U7.24 ; U6.37 28.39,25.57 arc(28.39,25.54) v1(28.41,25.51)
  Inner2 w0.152: v1(20.27,22.13) 20.27,23.98 arc(20.77,25.19) 21.97,25.68 26.29,25.68 arc(27.35,25.64) v1(28.41,25.51)
PWMCL1_25: length 11.5
  Top Layer w0.152: U3.3 6.32,19.57 arc(6.13,19.61) v1(5.97,19.72) ; v1(11.56,25.05) 11.56,26.32 arc(11.45,26.57) 11.21,26.67 U1.38
  Inner2 w0.152: v1(5.97,19.72) arc(9.83,21.26) v1(11.56,25.05)
PWMCL2_25: length 12.9
  Top Layer w0.152: U6.38 28.83,26.63 arc(28.98,26.56) 29.04,26.41 v1(29.04,25) ; U7.3 21.56,19.59 arc(21.37,19.62) v1(21.21,19.73)
  Inner2 w0.152: v1(21.21,19.73) arc(24.38,20.46) 26.92,22.51 arc(27.35,22.91) 27.81,23.27 arc(28.57,24.04) v1(29.04,25)
PWMIN1_00: length 5.1
  Top Layer w0.152: U1.43 11.75,28.67 arc(11.79,28.65) v1(11.81,28.61) arc(11.67,28.93) 11.34,29.07 10.9,29.07
  Bottom Layer w0.152: R88.2 13.86,29.04 arc(13.37,28.72) 12.8,28.61 v1(11.81,28.61)
PWMIN2_00: length 13
  Top Layer w0.152: U6.43 28.72,28.63 arc(28.98,28.73) v1(29.08,28.99) arc(29.07,29.01) 29.04,29.03 U6.44
  Bottom Layer w0.152: v1(29.08,28.99) 19.41,28.99 arc(18.58,29.15) R89.2
VBA1: length 4.9
  Top Layer w0.254: U3.20 9.43,21.52 arc(9.53,21.77) 9.78,21.87 10.92,21.87 arc(11.39,22.07) 11.59,22.54 11.59,23.02 C11.2
VBA2: length 5
  Top Layer w0.254: U7.20 24.67,21.77 arc(24.81,22.11) 25.15,22.26 26.32,22.26 arc(26.86,22.48) D5.1 28.42,23.02
VBB1: length 5.6
  Top Layer w0.254: U3.17 11.6,20.07 arc(12.13,20.17) D3.1 arc(13.98,19.9) 14.56,18.5 C12.2
VBB2: length 6
  Top Layer w0.254: U7.17 27.66,20.09 arc(27.93,20.2) D6.1 arc(29.44,19.9) 30.02,18.5 30.02,18.06
VBC1: length 5.1
  Top Layer w0.254: U3.14 11.05,18.57 arc(11.32,18.46) 11.43,18.19 11.43,15.87 arc(11.37,15.71) C14.2 D4.1
VBC2: length 5
  Top Layer w0.254: 28.05,15.65 C38.2 26.71,18.29 arc(26.62,18.5) 26.42,18.59 U7.14
VSA1: length 45.2
  Top Layer w0.254: 12.49,21.37 14.1,21.37 arc(14.42,21.5) 14.56,21.83 C11.1 ; 12.49,21.37 12.06,21.37 arc(11.8,21.25) 11.68,20.98 arc(11.56,20.69) 11.27,20.57 U3.18 ; 12.49,21.37 arc(12.46,21.38) 12.45,21.41 v1(12.45,21.87)
  Inner2 w0.203: v1(12.45,21.87) 12.45,24.29 arc(11.89,25.63) 10.54,26.19 4.7,26.19 arc(3.98,25.89) 3.68,25.18 3.68,18.32 arc(3.91,17.78) 4.44,17.56 4.82,17.56 arc(5.36,17.33) 5.59,16.79 5.59,8.43 arc(5.36,7.89) v1(4.82,7.67)
  Bottom Layer w0.152: R71.2 3.03,8.14 arc(2.77,8.03) 2.67,7.78 2.67,3.66 arc(2.66,3.64) PAD20.1
  vias: v1(1.6,3.54) v1(1.6,2.88) v1(1.6,2.23) v1(1.6,1.58) v1(2.28,2.23) v1(2.28,1.58)
VSA2: length 35.2
  Top Layer w0.203: v1(26.67,21.11) 26.67,20.6 arc(26.67,20.59) 26.65,20.59 ; 26.65,20.59 26.91,20.59 arc(27.1,20.66) 27.18,20.86 arc(27.25,21.04) 27.43,21.11 29.5,21.11 arc(29.91,21.28) 30.09,21.7 C36.1 ; 26.65,20.59 U7.18
  Inner2 w0.203: v1(19.22,4.24) 20.72,4.24 arc(21.16,4.42) 21.34,4.86 21.34,13.77 arc(21.27,14.1) 21.08,14.38 arc(20.89,14.66) 20.83,14.99 20.83,17.18 arc(21.13,17.89) 21.84,18.19 25.7,18.19 arc(26.39,18.47) 26.67,19.16 v1(26.67,21.11)
  Bottom Layer w0.152: R105.2 18.29,5.08 arc(18.33,4.65) 18.47,4.23 arc(18.65,3.92) PAD23.1
  vias: v1(17.78,4.24) v1(17.78,3.43) v1(18.5,4.24) v1(18.5,3.43) v1(19.22,3.43)
VSB1: length 26.4
  Top Layer w0.203: v1(13.84,15.4) 13.84,15.93 arc(13.61,17.09) C12.1
  Top Layer w0.254: C12.1 12.29,18.73 arc(11.92,18.98) 11.48,19.07 U3.15
  Inner2 w0.203: v1(13.84,15.4) 12.95,15.4 arc(12.42,15.17) 12.19,14.64 12.19,5.77 arc(11.99,4.97) 11.44,4.37 arc(11,4.16) 10.52,4.09 8.51,4.09 arc(8.4,4.14) v1(8.36,4.24)
  Bottom Layer w0.152: R72.2 8.89,4.45 arc(8.65,3.88) PAD21.1
  vias: v1(6.92,4.24) v1(6.92,3.43) v1(7.64,4.24) v1(7.64,3.43) v1(8.36,3.43)
VSB2: length 27.6
  Top Layer w0.203: v1(27.43,17.56) 27.91,17.56 arc(28.27,17.7) C37.1
  Top Layer w0.254: U7.15 27.4,19.09 arc(28.12,18.79) C37.1
  Inner2 w0.203: v1(23.19,4.24) arc(23.17,4.25) 23.16,4.26 23.16,16.72 arc(23.3,17.04) 23.62,17.18 26.51,17.18 arc(27.01,17.27) v1(27.43,17.56)
  Bottom Layer w0.152: v1(23.19,4.24) 21.63,5.79 arc(21.23,6.41) 21.08,7.13 21.08,7.53 arc(21.15,7.86) R106.2 ; 23.19,4.24 arc(23.66,3.8) PAD24.1
  vias: v1(23.19,3.43) v1(23.91,4.24) v1(23.91,3.43) v1(24.63,4.24) v1(24.63,3.43)
VSC1: length 19.7
  Top Layer w0.254: U3.12 9.93,15.97 arc(9.84,15.74) C14.1
  Bottom Layer w0.152: R73.2 14.07,4.24 arc(13.9,3.81) PAD22.1 arc(13,3.83) 12.8,4.31
  Bottom Layer w0.203: v1(9.91,15.4) 9.91,13.49 arc(10.17,12.86) 10.79,12.6 13.97,12.6 arc(14.51,12.38) 14.73,11.84 14.73,8.54 arc(14.61,8.26) 14.33,8.14 R73.2
  vias: v1(12.35,4.24) v1(12.35,3.43) v1(13.07,4.24) v1(13.07,3.43) v1(13.79,4.24) v1(13.79,3.43)
VSC2: length 20.6
  Top Layer w0.254: U7.12 25.17,15.71 arc(25.15,15.67) C38.1
  Inner2 w0.203: v1(28.6,4.24) 28.6,5.22 arc(28.44,5.59) 28.07,5.75 25.78,5.75 arc(25.33,5.93) 25.14,6.38 v1(25.14,15.41)
  Bottom Layer w0.152: 28.78,5.6 arc(28.63,5.97) 28.26,6.13 arc(27.94,6.26) 27.81,6.57 27.81,7.02 arc(27.66,7.37) 27.31,7.52 26.4,7.52 arc(25.96,7.7) R107.2
  vias: v1(28.6,3.43) v1(29.32,4.24) v1(29.32,3.43) v1(30.04,4.24) v1(30.04,3.43)
$1N883: length 4.6
  Top Layer w0.152: C55.2 R64.1 3.26,28.06 arc(3.47,28.14) 3.56,28.35 3.56,29.11 arc(3.66,29.37) 3.91,29.47 U1.16
$1N885: length 2.9
  Top Layer w0.152: U1.13 arc(5.08,30.67) 5.08,30.68 5.08,31.27 arc(5,31.46) 4.82,31.53 C52.2 arc(3.16,31.46) 3.23,31.43
$1N4560: length 3
  Top Layer w0.203: U4.4 22.73,35.01 arc(23,35.12) R83.1 R84.1
$1N4564: length 3.1
  Top Layer w0.203: U4.2 19.8,35.96 arc(20.08,36.07) 20.19,36.35 20.19,38.17 arc(20.15,38.26) C3.2
$1N14099: length 2.1
  Top Layer w0.254: Q1.2 4.85,5.05 arc(5.24,5.21) R74.1
$1N14121: length 1.5
  Top Layer w0.254: R75.1 4.94,4.06 arc(4.72,3.52) Q4.2
$1N14163: length 1.5
  Top Layer w0.254: R77.1 10.35,4.05 arc(10.13,3.52) 9.6,3.3
$1N14165: length 2.1
  Top Layer w0.254: R76.1 9.59,5.61 arc(9.19,5.45) Q2.2
$1N14207: length 5.3
  Top Layer w0.254: Q6.2 15.51,3.78 arc(15.69,4.04) v1(15.75,4.35)
  Bottom Layer w0.254: R79.1 16.64,6.49 arc(16.41,5.33) v1(15.75,4.35)
$1N14209: length 4.4
  Top Layer w0.254: Q3.2 15.31,5.05 arc(15.62,5.18) v1(15.75,5.49)
  Bottom Layer w0.254: v1(15.75,5.49) 15.75,7.76 arc(15.64,8.03) R78.1
$1N14280: length 1.9
  Top Layer w0.203: R82.2 arc(2.89,25.33) 2.77,25.15 2.01,24.4 arc(1.87,24.3) LED1.A
$1N14831: length 2
  Top Layer w0.254: R90.1 20.43,5.57 arc(20.06,5.42) Q7.2
$1N14833: length 1.5
  Top Layer w0.254: R91.1 21.18,4.02 arc(20.97,3.51) Q8.2
$1N14835: length 1.5
  Top Layer w0.254: R93.1 26.64,4.07 arc(26.41,3.52) Q10.2
$1N14837: length 2
  Top Layer w0.254: R92.1 25.83,5.57 arc(25.46,5.42) Q9.2
$1N14839: length 8.1
  Top Layer w0.152: Q12.2 31.33,3.3 arc(31.63,3.42) v1(31.75,3.71)
  Bottom Layer w0.152: v1(31.75,3.71) 31.75,5.11 arc(31.34,6.1) 30.35,6.51 29.4,6.51 arc(28.64,6.82) 28.32,7.59 28.32,7.78 arc(28.21,8.03) 27.96,8.14 R95.1
$1N14841: length 6.5
  Top Layer w0.152: v1(31.75,6.63) 31.75,5.75 arc(31.55,5.25) 31.05,5.05 Q11.2
  Bottom Layer w0.152: R94.1 28.83,7.27 arc(28.94,7) 29.21,6.89 31.5,6.89 arc(31.68,6.81) v1(31.75,6.63)
$1N14990: length 1.7
  Top Layer w0.152: LED3.A R96.2
$1N15402: length 4.3
  Top Layer w0.152: U6.16 21.65,29.43 arc(21.43,29.33) 21.34,29.11 21.34,28.99 arc(21.26,28.81) 21.08,28.73 20.83,28.73 arc(20.65,28.66) 20.58,28.48 R108.1 20.58,26.8
$1N15407: length 1.8
  Top Layer w0.152: U6.13 20.88,30.63 arc(20.85,30.64) C63.2
$1N15587: length 1.8
  Top Layer w0.203: C3.1 20.91,37.63 arc(21.13,37.12) U4.6
$1N15591: length 7
  Top Layer w0.203: R85.2 8.66,35.23 arc(8.91,35.33) 9.02,35.59 9.02,36.1 arc(9.17,36.46) 9.53,36.61 10.67,36.61 arc(11.03,36.46) 11.18,36.1 11.18,33.77 arc(11.28,33.53) LED2.1
$1N15642: length 22.9
  Top Layer w0.203: v1(22.73,33.3) 23.62,33.3 arc(23.86,33.4) 23.96,33.64 R84.2 ; R85.1 C69.2 7.89,37.39 arc(7.61,37.27) 7.49,36.99 7.49,34.96 arc(8.05,33.61) 9.4,33.05 v1(9.53,33.05)
  Inner2 w0.203: v1(9.53,33.05) arc(10.09,32.67) 10.75,32.54 20.89,32.54 arc(21.89,32.74) v1(22.73,33.3)
$1N22824: length 2
  Bottom Layer w0.152: R89.1 17.03,30.96 arc(17.16,31.27) 17.47,31.4
$1N22826: length 2
  Bottom Layer w0.152: R88.1 15.28,31.05 arc(15.18,31.3) 14.93,31.4

## Copper pours and planes (outline as drawn; the poured copper is in the pictures)
GND on Top Layer: 31.79,2.79 32.03,2.69 32.13,2.44 32.13,1.81 31.65,0.64 30.48,0.16 29.08,0.16 28.9,0.23 28.83,0.41 28.83,0.75 28.86,0.82 28.94,0.86 30.22,0.86 30.47,0.96 30.57,1.21 30.57,2.48 30.66,2.69 30.86,2.77 30.87,2.79
GND on Top Layer: 31.75,12.35 32.02,12.46 32.13,12.73 32.13,14.38 32.02,14.65 31.75,14.76 4.83,14.76 4.56,14.87 4.44,15.14 4.44,16.16 4.33,16.43 4.06,16.54 2.03,16.54 1.4,16.28 1.14,15.65 1.14,13.11 1.37,12.57 1.91,12.35
GND on Top Layer: 18.96,36.57 18.57,36.73 18.41,37.11 18.41,38.64 18.49,38.82 18.67,38.89 19.33,38.89 19.51,38.82 19.59,38.64 19.59,37.93 19.62,37.85 19.7,37.81 19.87,37.81 19.96,37.78 19.99,37.69 19.99,36.77 19.93,36.63 19.79,36.57
GND on Top Layer: 20.56,33.4 20.63,33.22 20.82,33.14 21.76,33.14 22.01,33.25 22.11,33.5 22.11,34.13 22.01,34.38 21.76,34.48 20.91,34.48 20.66,34.38 20.56,34.13
GND on Top Layer: 11.43,35.94 11.67,36.51 12.23,36.75 14.85,36.75 15.21,36.59 15.37,36.23 15.37,34.96 15.22,34.6 14.86,34.45 11.94,34.45 11.58,34.6 11.43,34.96
GND on Bottom Layer: 7.11,37.92 7.46,38.75 8.29,39.1 24.15,39.1 24.97,38.76 25.31,37.94 25.31,33.9 25.74,32.85 27.42,32.16 27.68,31.53 27.68,12.35 27.43,11.77 26.85,11.52 5.96,11.52 5.09,11.88 4.73,12.74 4.73,31.52 4.96,32.06 6.64,32.76 7.11,33.9
GND on Bottom Layer: 0.25,37.42 0.76,38.64 1.98,39.15 4.84,39.15 6.1,38.63 6.62,37.37 6.62,33.94 6.3,33.16 5.52,32.84 5.5,32.84 4.71,32.52 4.39,31.73 4.39,12.8 4.26,12.48 3.94,12.35 0.89,12.35 0.44,12.53 0.25,12.98
GND on Inner1: 2.62,39.27 3.25,39.4 30.4,39.4 31.81,38.81 32.4,37.4 32.4,5.86 32.09,5.11 31.33,4.8 6.03,4.8 5.09,5.18 4.7,6.13 4.7,31.8 4.49,32.29 4,32.49 1.13,32.49 0.33,32.83 0,33.62 0,37.4 0.59,38.81 2,39.4
GND on Inner1: 0.25,14.76 0.77,16.02 2.03,16.54 3.71,16.54 4.23,16.32 4.44,15.8 4.44,5.57 5.22,3.7 7.09,2.93 31.63,2.93 32.06,2.75 32.24,2.32 32.24,2.17 31.65,0.75 30.23,0.16 2.16,0.16 0.81,0.71 0.25,2.06
GND on Inner2: 2.62,39.27 3.25,39.4 30.4,39.4 31.81,38.81 32.4,37.4 32.4,5.86 32.09,5.11 31.33,4.8 6.03,4.8 5.09,5.18 4.7,6.13 4.7,31.8 4.49,32.29 4,32.49 1.13,32.49 0.33,32.83 0,33.62 0,37.4 0.59,38.81 2,39.4
GND on Inner2: 0.25,14.76 0.77,16.02 2.03,16.54 3.71,16.54 4.23,16.32 4.44,15.8 4.44,5.57 5.22,3.7 7.09,2.93 31.63,2.93 32.06,2.75 32.24,2.32 32.24,2.17 31.65,0.75 30.23,0.16 2.16,0.16 0.81,0.71 0.25,2.06
VBAT on Top Layer: 17.15,33.85 17.23,34.06 17.43,34.14 18.06,34.14 18.46,34.31 18.63,34.71 18.63,35.04 18.75,35.34 19.05,35.46 19.87,35.46 20.24,35.31 20.39,34.94 20.39,33.29 20.2,32.83 19.75,32.65 17.55,32.65 17.26,32.77 17.15,33.05
VBAT on Top Layer: 31.75,11.97 32.02,11.86 32.13,11.59 32.13,6.82 31.89,6.24 31.32,6 1.01,6 0.48,6.23 0.25,6.76 0.25,11.59 0.37,11.86 0.63,11.97
VBAT on Bottom Layer: 28.13,39.11 28.7,39.15 30.42,39.15 31.65,38.63 32.16,37.4 32.16,10.36 31.87,9.65 31.17,9.36 28.96,9.36 28.29,9.64 28.01,10.31 28.01,31.73 27.69,32.52 26.9,32.84 26.88,32.84 26.1,33.16 25.78,33.94 25.78,37.37 26.3,38.63 27.56,39.15
VSA1 on Top Layer: 0.25,4.62 0.54,5.31 1.23,5.6 3.04,5.6 3.21,5.53 3.28,5.36 3.28,1.36 3.17,1.09 2.91,0.98 1.21,0.98 0.53,1.26 0.25,1.94
VSA2 on Top Layer: 16.97,4.64 17.25,5.31 17.93,5.59 19.26,5.59 19.44,5.52 19.52,5.34 19.52,1.32 19.42,1.08 19.18,0.98 17.34,0.98 17.08,1.09 16.97,1.35
VSB1 on Top Layer: 6.12,4.64 6.4,5.31 7.07,5.59 8.41,5.59 8.59,5.52 8.66,5.34 8.66,1.32 8.56,1.08 8.33,0.98 6.48,0.98 6.22,1.09 6.12,1.35
VSB2 on Top Layer: 22.38,4.64 22.66,5.31 23.34,5.59 24.67,5.59 24.85,5.52 24.93,5.34 24.93,1.32 24.83,1.08 24.59,0.98 22.75,0.98 22.49,1.09 22.38,1.35
VSC1 on Top Layer: 11.54,4.64 11.83,5.31 12.5,5.59 13.83,5.59 14.01,5.52 14.09,5.34 14.09,1.32 13.99,1.08 13.75,0.98 11.91,0.98 11.65,1.09 11.54,1.35
VSC2 on Top Layer: 27.74,4.58 28.03,5.29 28.74,5.59 30.13,5.59 30.29,5.52 30.35,5.36 30.35,1.26 30.27,1.06 30.08,0.98 28.1,0.98 27.84,1.09 27.74,1.35
$1N4564 on Top Layer: 19.74,36.43 19.95,36.34 20.04,36.14 20.04,35.91 19.95,35.7 19.74,35.61 18.95,35.61 18.57,35.46 18.41,35.08 18.41,34.87 18.3,34.59 18.02,34.47 15.96,34.47 15.77,34.55 15.69,34.74 15.69,36.12 15.79,36.34 16.01,36.43
$1N15642 on Top Layer: 9.16,38.4 9.28,38.69 9.56,38.8 17.86,38.8 18.14,38.69 18.26,38.4 18.26,37.47 18.12,37.13 17.78,36.99 8.25,36.99 7.96,37.11 7.85,37.39 7.96,37.67 8.25,37.79 8.82,37.79 9.06,37.89 9.16,38.13
GND on Top Layer: 25.99,2.92 27.18,2.92 27.43,2.82 27.53,2.57 27.53,0.67 27.42,0.4 27.15,0.28 25.5,0.28 25.32,0.36 25.25,0.54 25.25,2.57 25.35,2.82 25.6,2.93 25.99,2.93
GND on Top Layer: 9.73,2.92 10.92,2.92 11.17,2.82 11.27,2.57 11.27,0.67 11.16,0.4 10.89,0.28 9.24,0.28 9.06,0.36 8.98,0.54 8.98,2.57 9.09,2.82 9.34,2.93 9.72,2.93
GND on Top Layer: 15.15,2.92 16.35,2.92 16.59,2.82 16.7,2.57 16.7,0.67 16.58,0.4 16.32,0.28 14.66,0.28 14.48,0.36 14.41,0.54 14.41,2.57 14.51,2.82 14.77,2.93 15.15,2.93
GND on Top Layer: 15.33,34.14 16.43,34.14 16.67,34.05 16.76,33.81 16.76,33.07 16.69,32.89 16.52,32.82 14.2,32.82 14.04,32.89 13.97,33.05 13.97,33.89 14.05,34.07 14.23,34.15 15.32,34.15
GND on Top Layer: 20.58,2.92 21.77,2.92 22.02,2.82 22.12,2.57 22.12,0.67 22.01,0.4 21.74,0.28 20.09,0.28 19.91,0.36 19.84,0.54 19.84,2.57 19.94,2.82 20.19,2.93 20.58,2.93
GND on Top Layer: 4.3,2.92 5.49,2.92 5.74,2.82 5.84,2.57 5.84,0.67 5.73,0.4 5.46,0.28 3.81,0.28 3.63,0.36 3.56,0.54 3.56,2.57 3.66,2.82 3.91,2.93 4.29,2.93

Small or netless copper shapes (teardrops, artwork), in the pictures only: 334 on Top Layer, 141 on Bottom Layer, 64 on Inner2

## Text on the board
Bottom Silkscreen Layer: GND | PWM2 | PWM1 | 5V | A | B | C
Top Silkscreen Layer: GND | RX | 5V | TX | ＋ | －
